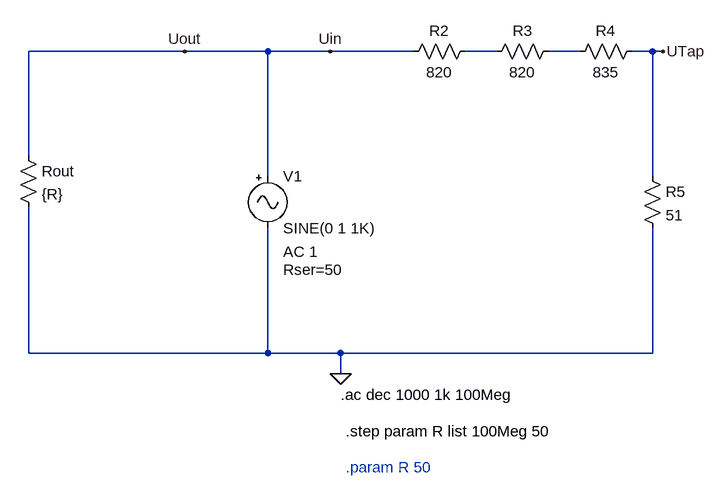
[diagram p0: schematic RFTap.asc]
RFTap.asc, the LTspice schematic file:
Version 4
SHEET 1 1764 1784
WIRE -1920 464 -2160 464
WIRE -1792 464 -1920 464
WIRE -1696 464 -1792 464
WIRE -1568 464 -1696 464
WIRE -1440 464 -1488 464
WIRE -1312 464 -1360 464
WIRE -1200 464 -1232 464
WIRE -1184 464 -1200 464
WIRE -2160 624 -2160 464
WIRE -1792 656 -1792 464
WIRE -1200 656 -1200 464
WIRE -2160 928 -2160 704
WIRE -1792 928 -1792 736
WIRE -1792 928 -2160 928
WIRE -1680 928 -1792 928
WIRE -1200 928 -1200 736
WIRE -1200 928 -1680 928
WIRE -1680 960 -1680 928
FLAG -1680 960 0
FLAG -1184 464 UTap
FLAG -1696 464 Uin
FLAG -1920 464 Uout
SYMBOL Misc\\signal -1792 640 R0
WINDOW 123 24 132 Left 2
WINDOW 39 24 160 Left 2
SYMATTR InstName V1
SYMATTR Value2 AC 1
SYMATTR SpiceLine Rser=50
SYMBOL res -2176 608 R0
SYMATTR InstName Rout
SYMATTR Value {R}
SYMBOL res -1472 448 R90
WINDOW 0 0 56 VBottom 2
WINDOW 3 32 56 VTop 2
SYMATTR InstName R2
SYMATTR Value 820
SYMBOL res -1344 448 R90
WINDOW 0 0 56 VBottom 2
WINDOW 3 32 56 VTop 2
SYMATTR InstName R3
SYMATTR Value 820
SYMBOL res -1216 448 R90
WINDOW 0 0 56 VBottom 2
WINDOW 3 32 56 VTop 2
SYMATTR InstName R4
SYMATTR Value 835
SYMBOL res -1216 640 R0
SYMATTR InstName R5
SYMATTR Value 51
TEXT -1680 992 Left 2 !.ac dec 1000 1k 100Meg
TEXT -1672 1048 Left 2 !.step param R list 100Meg 50
TEXT -1672 1104 Left 2 ;.param R 50

The netlist it stands for:
* RFTap.asc
V1 Uout 0 SINE(0 1 1K) AC 1 Rser=50
Rout Uout 0 {R}
R2 N001 Uout 820
R3 N002 N001 820
R4 UTap N002 835
R5 UTap 0 51
.ac dec 1000 1k 100Meg
.step param R list 100Meg 50
* .param R 50
.backanno
.end